# Altium project Portable_power_supply_v1.PrjPcb
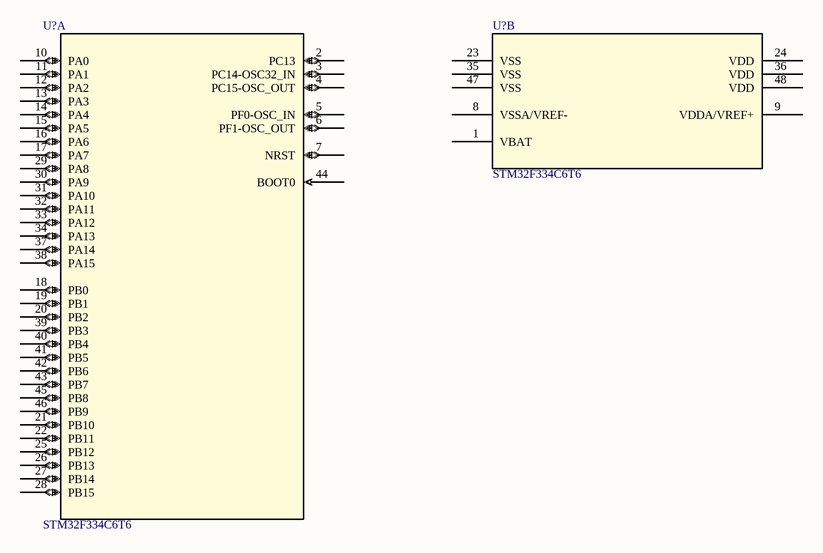
[diagram p0: Control.SchDoc]
4 sheets, 64 parts. Net scope: flat (ports and power ports of the same name join across sheets).
Sheets:
  Control.SchDoc
  Power.SchDoc
  Front(QC_PD).SchDoc
  VoltageRegulator.SchDoc

## Sheet Control.SchDoc
size A4; SheetNumber: 1; SheetTotal: 4

### Parts
(Parts that share a designator on the sheet are numbered #1, #2 ... from top to bottom, then left to right.)
U?#1  STM32F334C6T6  [LQFP48-7x7mm]  (part A of 2)
U?#2  STM32F334C6T6  [LQFP48-7x7mm]  (part B of 2)

### Nets

Not connected (* = marked no-connect by the designer): U?#1 2(PC13) 3(PC14-OSC32_IN) 4(PC15-OSC_OUT) 5(PF0-OSC_IN) 6(PF1-OSC_OUT) 7(NRST) 10(PA0) 11(PA1) 12(PA2) 13(PA3) 14(PA4) 15(PA5) 16(PA6) 17(PA7) 18(PB0) 19(PB1) 20(PB2) 21(PB10) 22(PB11) 25(PB12) 26(PB13) 27(PB14) 28(PB15) 29(PA8) 30(PA9) 31(PA10) 32(PA11) 33(PA12) 34(PA13) 37(PA14) 38(PA15) 39(PB3) 40(PB4) 41(PB5) 42(PB6) 43(PB7) 44(BOOT0) 45(PB8) 46(PB9); U?#2 1(VBAT) 8(VSSA/VREF-) 9(VDDA/VREF+) 23(VSS) 24(VDD) 35(VSS) 36(VDD) 47(VSS) 48(VDD)

### Library data of the parts
U?#1 U?#2 = STM32F334C6T6: No Description Available; Mfr_Name: STMicroelectronics; Copyright: Copyright (C) 2021 Ultra Librarian. All rights reserved.; Manufacturer_Part_Number: STM32F334C6T6; RefDes: RefDes; Type: DEV

## Sheet Power.SchDoc
size A4; SheetNumber: 2; SheetTotal: 4
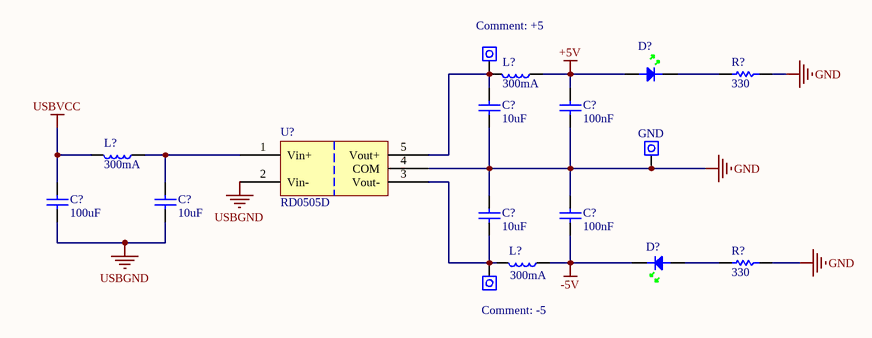
[diagram p1: Power.SchDoc]

### Parts
(Parts that share a designator on the sheet are numbered #1, #2 ... from top to bottom, then left to right.)
C?#1  10uF  [0805C]
C?#2  100nF  [0805C]
C?#3  100uF  [0805C]
C?#4  10uF  [0805C]
C?#5  10uF  [0805C]
C?#6  100nF  [0805C]
D?#1  (no value)  [0805D-GREEN]
D?#2  (no value)  [0805D-GREEN]
L?#1  300mA  [0805]
L?#2  300mA  [0805]
L?#3  300mA  [0805]
R?#1  330  [0805]
R?#2  330  [0805]
TP?#1  +5  [PIN 1.8mm]
TP?#2  GND  [PIN 1.8mm]
TP?#3  -5  [PIN 1.8mm]
U?#3  RD0505D  [SIP_NMG]

### Nets
+5V: C?#2.1 D?#1.A L?#1.1
-5V: C?#6.2 D?#2.K L?#3.1
GND: C?#1.2 C?#2.2 C?#5.1 C?#6.1 R?#1.1 R?#2.1 TP?#2.1 U?#3.4(COM)
USBGND: C?#3.2 C?#4.2 U?#3.2(Vin-)
USBVCC: C?#3.1 L?#2.2
NetC?#1_1: C?#1.1 L?#1.2 TP?#1.1 U?#3.5(Vout+)
NetC?#4_1: C?#4.1 L?#2.1 U?#3.1(Vin+)
NetC?#5_2: C?#5.2 L?#3.2 TP?#3.1 U?#3.3(Vout-)
NetD?#1_K: D?#1.K R?#1.2
NetD?#2_A: D?#2.A R?#2.2

### Library data of the parts
C?#1-C?#6 = C: Capacitor; Reviewed by: RM - 2018/08/05; Revision: July-2002: Re-released for DXP Platform.; Supplier 1: *; Supplier Part Number 1: *
  C?#1 C?#4 C?#5: Value: 10uF
  C?#2 C?#6: Value: 100nF
  C?#3: Value: 100uF
D?#1 D?#2 = LED GREEN: Light Emitting Diode; Reviewed by: RM - 2018/08/05; Revision: July-2002: Re-released for DXP Platform.; Supplier 1: Digi-Key; Supplier Part Number 1: 160-1423-1-ND
L?#1-L?#3 = I: Inductor; Reviewed by: RM - 2018/08/05; Supplier 1: *; Supplier Part Number 1: *; Value: 300mA
R?#1 R?#2 = R: Resistor; Reviewed by: RM - 2018/08/05; Supplier 1: *; Suppler Part Number 1: *; Value: 330
TP?#1-TP?#3 = WIRE: Pad
U?#3 = RD0505D: (ADV) DC to DC converter 5V in +-5V out; Reviewed by: RM - 2018/08/05; Supplier Part Number 1: 945-1136-ND; Supplier 1: Digi-Key

## Sheet Front(QC_PD).SchDoc
size A4; SheetNumber: 3; SheetTotal: 4
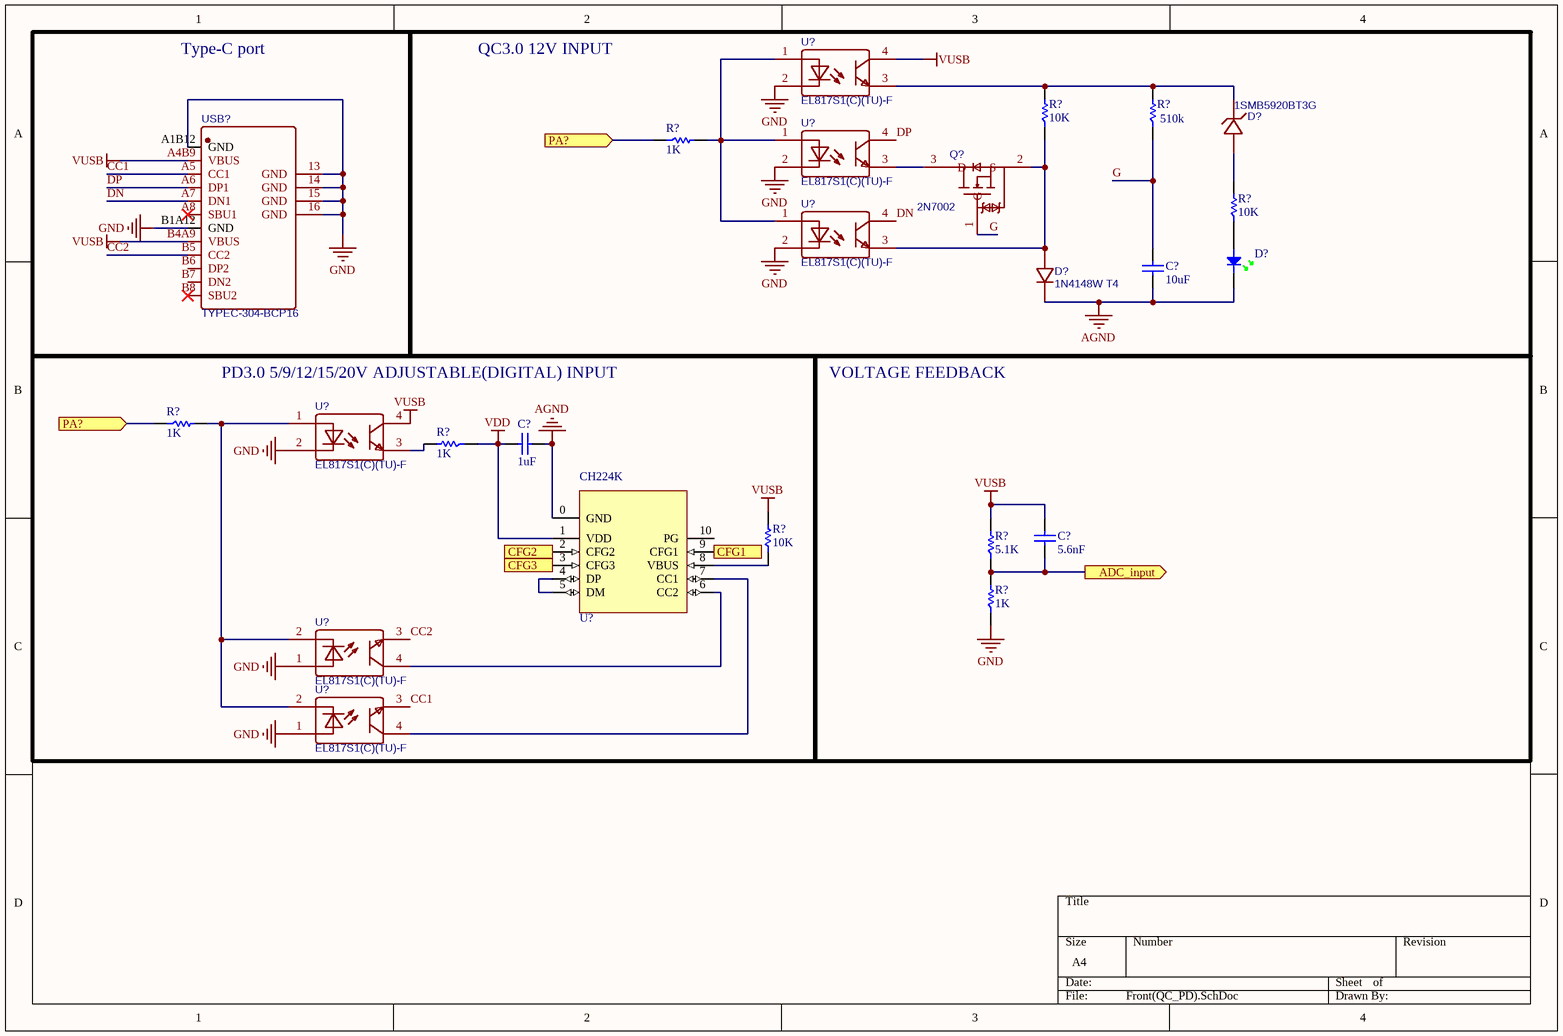
[diagram p2: Front(QC_PD).SchDoc]

### Parts
(Parts that share a designator on the sheet are numbered #1, #2 ... from top to bottom, then left to right.)
C?#7  10uF  [0805C]
C?#8  1uF  [0805C]
C?#9  5.6nF  [0805C]
D?#3  1SMB5920BT3G  [SMB_L4.6-W3.6-LS5.3-RD]
D?#4  (no value)  [0805D-GREEN]
D?#5  1N4148W T4  [SOD-123_L2.8-W1.8-LS3.7-RD]
Q?  2N7002  [SOT-23-3_L2.9-W1.3-P1.90-LS2.4-BR]
R?#3  10K  [0805]
R?#4  510k  [0805]
R?#5  1K  [0805]
R?#6  10K  [0805]
R?#7  1K  [0805]
R?#8  1K  [0805]
R?#9  10K  [0805]
R?#10  5.1K  [0805]
R?#11  1K  [0805]
U?#4  EL817S1(C)(TU)-F  [OPTO-SMD-4_L4.6-W6.5-P2.54-LS10.3-TL]
U?#5  EL817S1(C)(TU)-F  [OPTO-SMD-4_L4.6-W6.5-P2.54-LS10.3-TL]
U?#6  EL817S1(C)(TU)-F  [OPTO-SMD-4_L4.6-W6.5-P2.54-LS10.3-TL]
U?#7  EL817S1(C)(TU)-F  [OPTO-SMD-4_L4.6-W6.5-P2.54-LS10.3-TL]
U?#8  CH224K  [ESSOP10]
U?#9  EL817S1(C)(TU)-F  [OPTO-SMD-4_L4.6-W6.5-P2.54-LS10.3-TL]
U?#10  EL817S1(C)(TU)-F  [OPTO-SMD-4_L4.6-W6.5-P2.54-LS10.3-TL]
USB?  TYPEC-304-BCP16  [USB-C-SMD_TYPEC-304-BCP16]

### Blocks framed on the sheet
Type-C port: USB?
QC3.0 12V INPUT: C?#7 D?#3-D?#5 Q? R?#3-R?#6 U?#4-U?#6
PD3.0 5/9/12/15/20V ADJUSTABLE(DIGITAL) INPUT: C?#8 R?#7-R?#9 U?#7-U?#10
VOLTAGE FEEDBACK: C?#9 R?#10 R?#11

### Ports
ADC_input (out), CFG1 (in), CFG2 (in), CFG3 (in), PA? (in)

### Nets
AGND: C?#7.2 C?#8.1 D?#4.K D?#5.1(K) U?#8.0(GND)
GND: R?#11.1 U?#4.2(CAT) U?#5.2(CAT) U?#6.2(CAT) U?#7.2(CAT) U?#9.1(AN) U?#10.1(AN) USB?.13(GND) USB?.14(GND) USB?.15(GND) USB?.16(GND) USB?.A1B12(GND) USB?.B1A12(GND)
VDD: C?#8.2 R?#8.1 U?#8.1(VDD)
VUSB: C?#9.1 R?#9.2 R?#10.2 U?#4.4(COL) U?#7.4(COL) USB?.A4B9(VBUS) USB?.B4A9(VBUS)
CC1: U?#10.3(EM) USB?.A5(CC1)
CC2: U?#9.3(EM) USB?.B5(CC2)
DN: U?#6.4(COL) USB?.A7(DN1)
DP: U?#5.4(COL) USB?.A6(DP1)
G: C?#7.1 Q?.1(G) R?#4.1
NetC?#9_2: C?#9.2 R?#10.1 R?#11.2 ; port ADC_input
NetD?#3_1: D?#3.1(K) R?#3.2 R?#4.2 U?#4.3(EM)
NetD?#3_2: D?#3.2(A) R?#6.2
NetD?#4_A: D?#4.A R?#6.1
NetD?#5_2: D?#5.2(A) Q?.2(S) R?#3.1 U?#6.3(EM)
NetQ?_3: Q?.3(D) U?#5.3(EM)
NetR?#5_1: R?#5.1 R?#7.1 ; port PA?
NetR?#5_2: R?#5.2 U?#4.1(AN) U?#5.1(AN) U?#6.1(AN)
NetR?#7_2: R?#7.2 U?#7.1(AN) U?#9.2(CAT) U?#10.2(CAT)
NetR?#8_2: R?#8.2 U?#7.3(EM)
NetR?#9_1: R?#9.1 U?#8.8(VBUS)
NetU?#8_2: U?#8.2(CFG2) ; port CFG2
NetU?#8_3: U?#8.3(CFG3) ; port CFG3
NetU?#8_4: U?#8.4(DP) U?#8.5(DM)
NetU?#8_6: U?#8.6(CC2) U?#9.4(COL)
NetU?#8_7: U?#8.7(CC1) U?#10.4(COL)
NetU?#8_9: U?#8.9(CFG1) ; port CFG1

Not connected (* = marked no-connect by the designer): U?#8 10(PG); USB? A8(SBU1)* B6(DP2) B7(DN2) B8(SBU2)*

### Library data of the parts
C?#7 = C_5: Capacitor; Reviewed by: RM - 2018/08/05; Revision: July-2002: Re-released for DXP Platform.; Supplier 1: *; Supplier Part Number 1: *; Value: 10uF
C?#8 = C_3: Capacitor; Reviewed by: RM - 2018/08/05; Revision: July-2002: Re-released for DXP Platform.; Supplier 1: *; Supplier Part Number 1: *; Value: 1uF
C?#9 = C_7: Capacitor; Reviewed by: RM - 2018/08/05; Revision: July-2002: Re-released for DXP Platform.; Supplier 1: *; Supplier Part Number 1: *; Value: 5.6nF
D?#3 = 1SMB5920BT3G: BOM_Manufacturer: ON; BOM_Supplier: LCSC; BOM_Manufacturer Part: 1SMB5920BT3G; BOM_Supplier Part: C50527; BOM_JLCPCB Part Class: Extended Part; spicePre: D; spiceSymbolName: 1SMB5920BT3G
D?#4 = LED GREEN: as D?#1 on sheet Power; Revision: July-2002: Re-released for DXP Platform.; Supplier 1: Digi-Key; Supplier Part Number 1: 160-1423-1-ND
D?#5 = 1N4148W T4: BOM_Manufacturer: CJ; Contributor: 立创EDA官方封装库; BOM_Supplier: LCSC; BOM_Manufacturer Part: 1N4148W T4; BOM_Supplier Part: C2099; BOM_JLCPCB Part Class: Extended Part; spicePre: D; spiceSymbolName: 1N4148W T4
Q? = 2N7002: BOM_Manufacturer: JSMSEMI(杰盛微); Contributor: LCSC; BOM_Supplier: LCSC; BOM_Supplier Part: C916396; BOM_Manufacturer Part: 2N7002; BOM_JLCPCB Part Class: Extended Part; spicePre: Q; spiceSymbolName: 2N7002_C916396
R?#3 R?#6 R?#9 = R_8: Resistor; Reviewed by: RM - 2018/08/05; Supplier 1: *; Suppler Part Number 1: *; Value: 10K
R?#4 = R_4: Resistor; Reviewed by: RM - 2018/08/05; Supplier 1: *; Suppler Part Number 1: *; Value: 510k
R?#5 R?#7 R?#8 R?#11 = R_6: Resistor; Reviewed by: RM - 2018/08/05; Supplier 1: *; Suppler Part Number 1: *; Value: 1K
R?#10 = R_1: Resistor; Reviewed by: RM - 2018/08/05; Supplier 1: *; Suppler Part Number 1: *; Value: 5.1K
U?#4-U?#7 U?#9 U?#10 = EL817S1(C)(TU)-F: BOM_Manufacturer: EVERLIGHT; BOM_Supplier: LCSC; BOM_Manufacturer Part: EL817S1(C)(TU)-F; BOM_Supplier Part: C106900; BOM_JLCPCB Part Class: Basic Part; spicePre: U; spiceSymbolName: EL817S1(C)(TU)-F
U?#8 = CH224K: USB PD & Type-C & Fast Charge Power Consumer Controller
USB? = TYPEC-304-BCP16: BOM_Manufacturer: XUNPU; Contributor: LCSC; BOM_Supplier: LCSC; BOM_Supplier Part: C720629; BOM_Manufacturer Part: TYPEC-304-BCP16; BOM_JLCPCB Part Class: Extended Part; spicePre: U; spiceSymbolName: TYPEC-304-BCP16

## Sheet VoltageRegulator.SchDoc
size A4; SheetNumber: 4; SheetTotal: 4
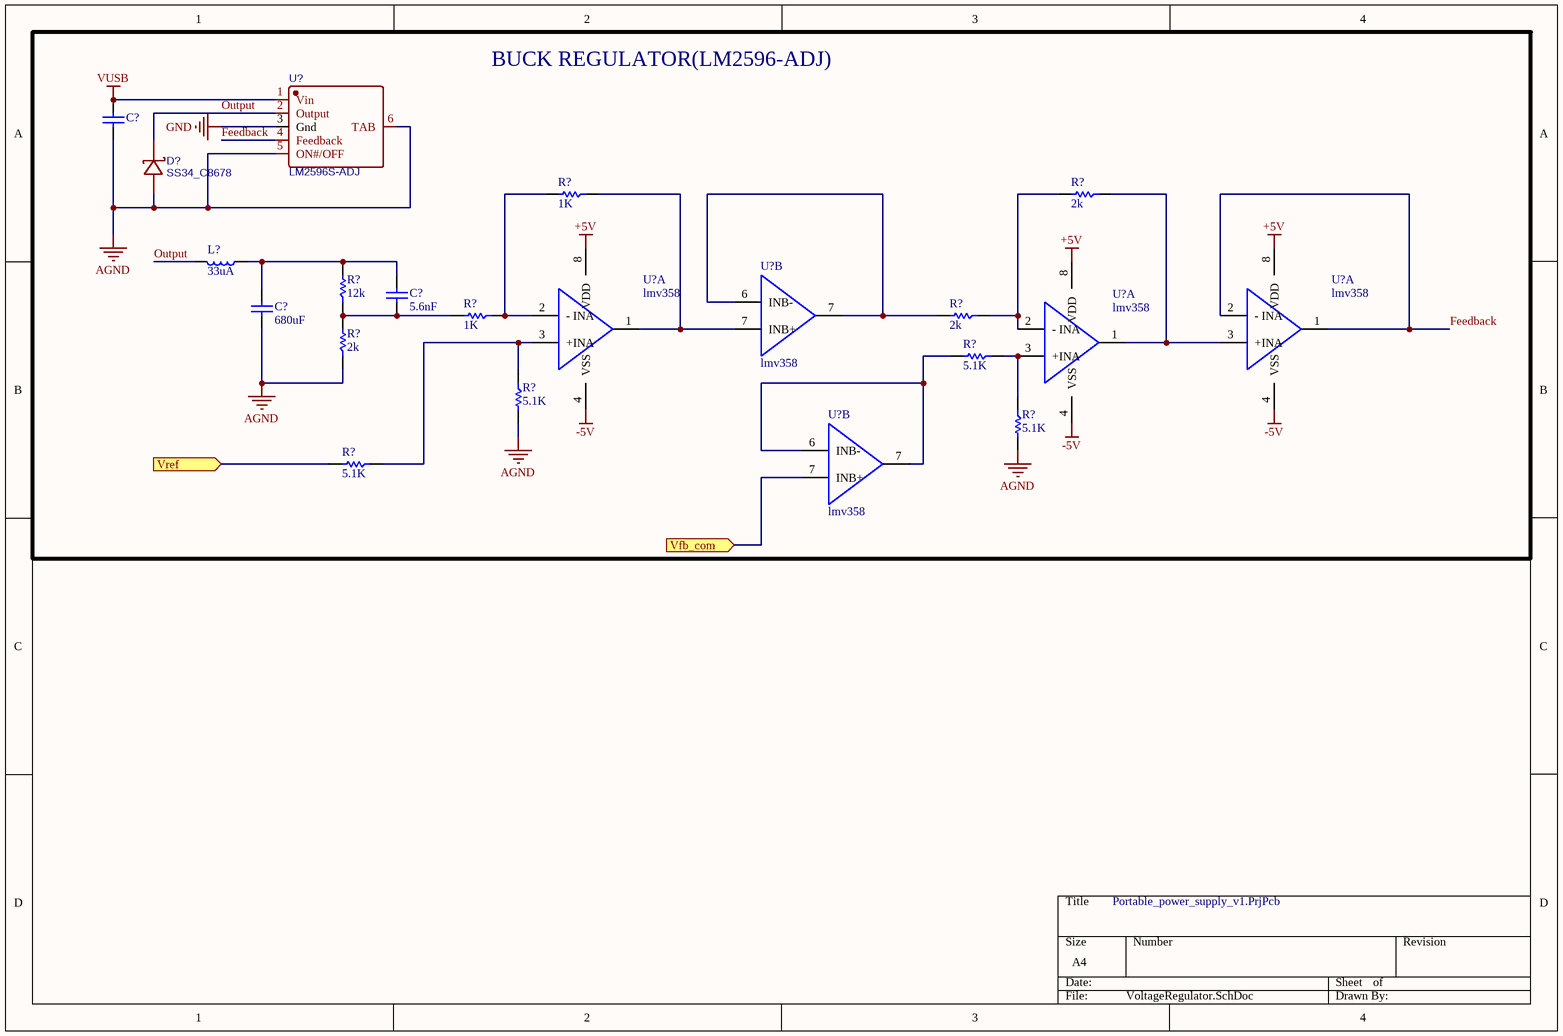
[diagram p3: VoltageRegulator.SchDoc]

### Parts
(Parts that share a designator on the sheet are numbered #1, #2 ... from top to bottom, then left to right.)
C?#10  (no value)  [0805C]
C?#11  680uF  [0805C]
C?#12  5.6nF  [0805C]
D?#6  SS34_C8678  [DO-214AC_L4.3-W2.7-LS5.3-RD]
L?#4  33uA  [0805]
R?#12  1K  [0805]
R?#13  2k  [0805]
R?#14  12k  [0805]
R?#15  2k  [0805]
R?#16  1K  [0805]
R?#17  2k  [0805]
R?#18  5.1K  [0805]
R?#19  5.1K  [0805]
R?#20  5.1K  [0805]
R?#21  5.1K  [0805]
U?#11  LM2596S-ADJ  [TO-263-5_L10.2-W8.9-P1.70-BR]
U?#12  lmv358  [SOP-8_L4.9-W3.9-P1.27-LS6.0-BL]  (part B of 2)
U?#13  lmv358  [SOP-8_L4.9-W3.9-P1.27-LS6.0-BL]  (part A of 2)
U?#14  lmv358  [SOP-8_L4.9-W3.9-P1.27-LS6.0-BL]  (part A of 2)
U?#15  lmv358  [SOP-8_L4.9-W3.9-P1.27-LS6.0-BL]  (part A of 2)
U?#16  lmv358  [SOP-8_L4.9-W3.9-P1.27-LS6.0-BL]  (part B of 2)

### Blocks framed on the sheet
BUCK REGULATOR(LM2596-ADJ): C?#10-C?#12 D?#6 L?#4 R?#12-R?#21 U?#11-U?#16

### Ports
Vfb_com (in), Vref (in)

### Nets
+5V: U?#13.8(VDD) U?#14.8(VDD) U?#15.8(VDD)
-5V: U?#13.4(VSS) U?#14.4(VSS) U?#15.4(VSS)
AGND: C?#10.2 C?#11.1 D?#6.2(A) R?#15.1 R?#19.2 R?#20.2 U?#11.5(ON#/OFF) U?#11.6(TAB)
GND: U?#11.3(Gnd)
VUSB: C?#10.1 U?#11.1(Vin)
Feedback: U?#11.4(Feedback) U?#14.1(OUTA) U?#14.2(-_INA)
Output: D?#6.1(K) L?#4.2 U?#11.2(Output)
NetC?#11_2: C?#11.2 C?#12.1 L?#4.1 R?#14.2
NetC?#12_2: C?#12.2 R?#14.1 R?#15.2 R?#16.2
NetR?#12_1: R?#12.1 U?#12.7(INB+) U?#13.1(OUTA)
NetR?#12_2: R?#12.2 R?#16.1 U?#13.2(-_INA)
NetR?#13_1: R?#13.1 U?#14.3(+INA) U?#15.1(OUTA)
NetR?#13_2: R?#13.2 R?#17.1 U?#15.2(-_INA)
NetR?#17_2: R?#17.2 U?#12.6(INB-) U?#12.7(OUTB)
NetR?#18_1: R?#18.1 R?#20.1 U?#15.3(+INA)
NetR?#18_2: R?#18.2 U?#16.6(INB-) U?#16.7(OUTB)
NetR?#19_1: R?#19.1 R?#21.1 U?#13.3(+INA)
NetR?#21_2: R?#21.2 ; port Vref
NetU?#16_7: U?#16.7(INB+) ; port Vfb_com

### Library data of the parts
C?#10 = C_10: Capacitor; Reviewed by: RM - 2018/08/05; Revision: July-2002: Re-released for DXP Platform.; Supplier 1: *; Supplier Part Number 1: *
C?#11 = C_11: Capacitor; Reviewed by: RM - 2018/08/05; Revision: July-2002: Re-released for DXP Platform.; Supplier 1: *; Supplier Part Number 1: *; Value: 680uF
C?#12 = C_7: Capacitor; Reviewed by: RM - 2018/08/05; Revision: July-2002: Re-released for DXP Platform.; Supplier 1: *; Supplier Part Number 1: *; Value: 5.6nF
D?#6 = SS34_C8678: BOM_Manufacturer Part: SS34; BOM_Manufacturer: MDD; BOM_Supplier: LCSC; BOM_Supplier Part: C8678; BOM_JLCPCB Part Class: Basic Part; spicePre: D; spiceSymbolName: SS34_C8678
L?#4 = I: Inductor; Reviewed by: RM - 2018/08/05; Supplier 1: *; Supplier Part Number 1: *; Value: 33uA
R?#12 R?#16 = R_6: Resistor; Reviewed by: RM - 2018/08/05; Supplier 1: *; Suppler Part Number 1: *; Value: 1K
R?#13 R?#15 R?#17 = R_3: Resistor; Reviewed by: RM - 2018/08/05; Supplier 1: *; Suppler Part Number 1: *; Value: 2k
R?#14 = R_2: Resistor; Reviewed by: RM - 2018/08/05; Supplier 1: *; Suppler Part Number 1: *; Value: 12k
R?#18-R?#21 = R_1: Resistor; Reviewed by: RM - 2018/08/05; Supplier 1: *; Suppler Part Number 1: *; Value: 5.1K
U?#11 = LM2596S-ADJ: BOM_Manufacturer: UMW(Youtai Semiconductor Co., Ltd.); Contributor: LCSC; BOM_Supplier: LCSC; BOM_Supplier Part: C347423; BOM_Manufacturer Part: LM2596S-ADJ; BOM_JLCPCB Part Class: Extended Part; spicePre: U; spiceSymbolName: LM2596S-ADJ
U?#12-U?#16 = LMV358-SR: OpAmp High Frequency Dual; Reviewed by: RM - 2018/08/05

## Nets that join several sheets
+5V: Power (C?#2.1 D?#1.A L?#1.1), VoltageRegulator (U?#13.8 U?#14.8 U?#15.8)
-5V: Power (C?#6.2 D?#2.K L?#3.1), VoltageRegulator (U?#13.4 U?#14.4 U?#15.4)
AGND: Front(QC_PD) (5 pins), VoltageRegulator (8 pins)
GND: Power (8 pins), Front(QC_PD) (13 pins), VoltageRegulator (U?#11.3)
VUSB: Front(QC_PD) (7 pins), VoltageRegulator (C?#10.1 U?#11.1)